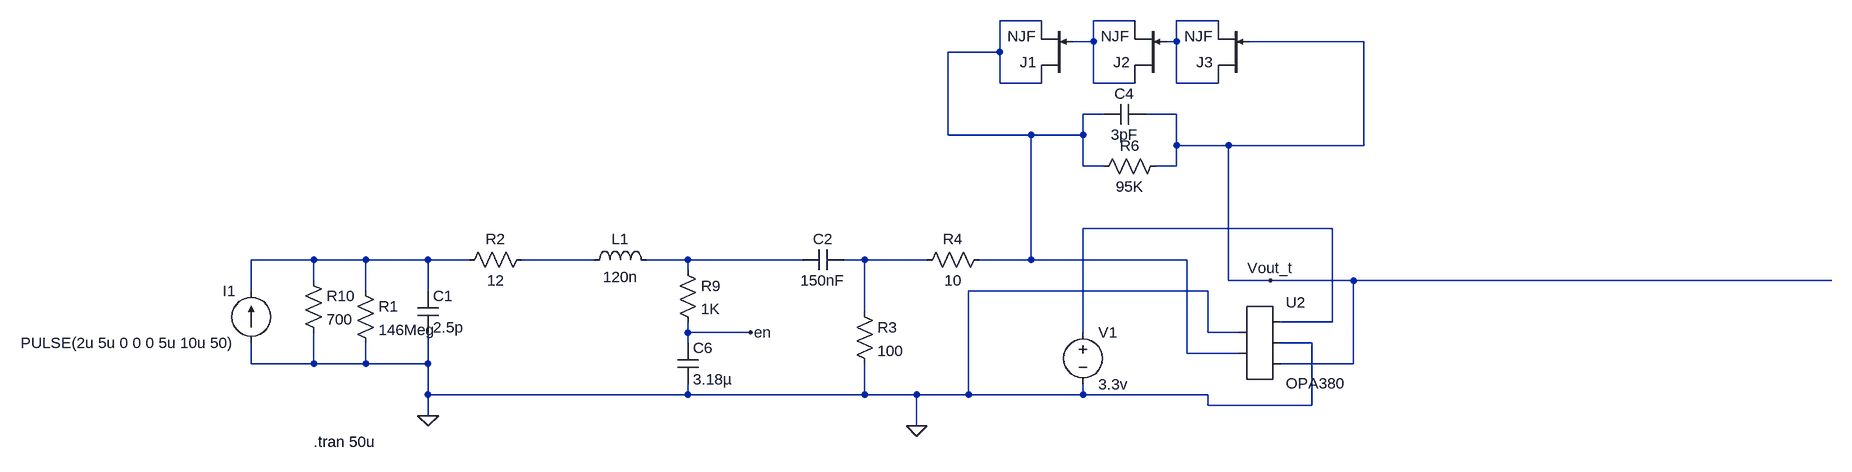
[diagram p0: schematic Draft4.asc]
Draft4.asc, the LTspice schematic file:
Version 4
SHEET 1 2192 768
WIRE 608 32 544 32
WIRE 752 32 688 32
WIRE 880 32 816 32
WIRE 688 64 688 32
WIRE 688 64 656 64
WIRE 816 64 816 32
WIRE 816 64 800 64
WIRE 1104 64 928 64
WIRE 544 80 544 32
WIRE 544 80 464 80
WIRE 544 128 544 80
WIRE 608 128 544 128
WIRE 688 128 688 64
WIRE 752 128 688 128
WIRE 816 128 816 64
WIRE 880 128 816 128
WIRE 704 176 672 176
WIRE 816 176 768 176
WIRE 464 208 464 80
WIRE 592 208 464 208
WIRE 672 208 672 176
WIRE 672 208 592 208
WIRE 816 224 816 176
WIRE 896 224 816 224
WIRE 1104 224 1104 64
WIRE 1104 224 896 224
WIRE 672 256 672 208
WIRE 704 256 672 256
WIRE 816 256 816 224
WIRE 816 256 784 256
WIRE 1056 352 672 352
WIRE -512 400 -608 400
WIRE -432 400 -512 400
WIRE -336 400 -432 400
WIRE -272 400 -336 400
WIRE -80 400 -192 400
WIRE 64 400 0 400
WIRE 240 400 64 400
WIRE 336 400 304 400
WIRE 432 400 336 400
WIRE 592 400 592 208
WIRE 592 400 512 400
WIRE 832 400 592 400
WIRE 64 416 64 400
WIRE -512 432 -512 400
WIRE 896 432 896 224
WIRE 960 432 896 432
WIRE 1088 432 960 432
WIRE 1824 432 1088 432
WIRE -608 448 -608 400
WIRE -432 448 -432 400
WIRE -336 448 -336 400
WIRE 864 448 496 448
WIRE 336 480 336 400
WIRE 1056 496 1056 352
WIRE 1056 496 976 496
WIRE 64 512 64 496
WIRE 160 512 64 512
WIRE 672 512 672 352
WIRE 864 512 864 448
WIRE 912 512 864 512
WIRE 64 528 64 512
WIRE 1024 528 976 528
WIRE 832 544 832 400
WIRE 912 544 832 544
WIRE -608 560 -608 528
WIRE -512 560 -512 512
WIRE -512 560 -608 560
WIRE -432 560 -432 528
WIRE -432 560 -512 560
WIRE -336 560 -336 512
WIRE -336 560 -432 560
WIRE 1088 560 1088 432
WIRE 1088 560 976 560
WIRE -336 608 -336 560
WIRE 64 608 64 592
WIRE 64 608 -336 608
WIRE 336 608 336 560
WIRE 336 608 64 608
WIRE 416 608 336 608
WIRE 496 608 496 448
WIRE 496 608 416 608
WIRE 672 608 672 592
WIRE 672 608 496 608
WIRE 864 608 672 608
WIRE 864 624 864 608
WIRE 1024 624 1024 528
WIRE 1024 624 864 624
WIRE -336 640 -336 608
WIRE 416 656 416 608
FLAG -336 640 0
FLAG 960 432 Vout_t
FLAG 416 656 0
FLAG 160 512 en
SYMBOL res -448 432 R0
SYMATTR InstName R1
SYMATTR Value 146Meg
SYMBOL cap -352 448 R0
SYMATTR InstName C1
SYMATTR Value 2.5p
SYMBOL res -176 384 R90
WINDOW 0 0 56 VBottom 2
WINDOW 3 32 56 VTop 2
SYMATTR InstName R2
SYMATTR Value 12
SYMBOL current -608 528 R180
WINDOW 3 24 0 Left 2
WINDOW 0 24 80 Left 2
SYMATTR Value PULSE(2u 5u 0 0 0 5u 10u 50)
SYMATTR InstName I1
SYMATTR Value2 AC .5u 0
SYMBOL Cap 304 384 R90
WINDOW 0 0 32 VBottom 2
WINDOW 3 32 32 VTop 2
SYMATTR InstName C2
SYMATTR Value 150nF
SYMBOL ind -96 416 R270
WINDOW 0 32 56 VTop 2
WINDOW 3 5 56 VBottom 2
SYMATTR InstName L1
SYMATTR Value 120n
SYMBOL Res 320 464 R0
SYMATTR InstName R3
SYMATTR Value 100
SYMBOL voltage 672 496 R0
SYMATTR InstName V1
SYMATTR Value 3.3v
SYMBOL Res 800 240 R90
WINDOW 0 0 56 VBottom 2
WINDOW 3 32 56 VTop 2
SYMATTR InstName R6
SYMATTR Value 95K
SYMBOL Cap 768 160 R90
WINDOW 0 0 32 VBottom 2
WINDOW 3 32 32 VTop 2
SYMATTR InstName C4
SYMATTR Value 3pF
SYMBOL njf 656 128 R180
SYMATTR InstName J1
SYMBOL njf 800 128 R180
SYMATTR InstName J2
SYMBOL njf 928 128 R180
SYMATTR InstName J3
SYMBOL AutoGenerated/OPA380 944 528 R0
SYMATTR InstName U2
SYMBOL Res 48 400 R0
SYMATTR InstName R9
SYMATTR Value 1K
SYMBOL Cap 48 528 R0
SYMATTR InstName C6
SYMATTR Value 3.18µ
SYMBOL Res -528 416 R0
SYMATTR InstName R10
SYMATTR Value 700
SYMBOL Res 528 384 R90
WINDOW 0 0 56 VBottom 2
WINDOW 3 32 56 VTop 2
SYMATTR InstName R4
SYMATTR Value 10
TEXT -512 680 Left 2 !.tran 50u

The netlist it stands for:
* Draft4.asc
R1 N005 0 146Meg
C1 N005 0 2.5p
R2 N006 N005 12
I1 0 N005 PULSE(2u 5u 0 0 0 5u 10u 50) AC .5u 0
C2 N008 N007 150nF
L1 N006 N007 120n
R3 N008 0 100
V1 N004 0 3.3v
R6 Vout_t N001 95K
C4 Vout_t N001 3pF
J1 N001 N002 N001 NJF
J2 N002 N003 N002 NJF
J3 N003 Vout_t N003 NJF
* U2: OPA380 (symbol AutoGenerated/OPA380 not available, pins judged from their places): pin1=0 pin2=N001 pin3=N004 pin4=0 pin5=Vout_t
R9 N007 en 1K
C6 en 0 3.18µ
R10 N005 0 700
R4 N001 N008 10
.model NJF NJF
.model PJF PJF
.lib standard.jft
.tran 50u
.backanno
.end